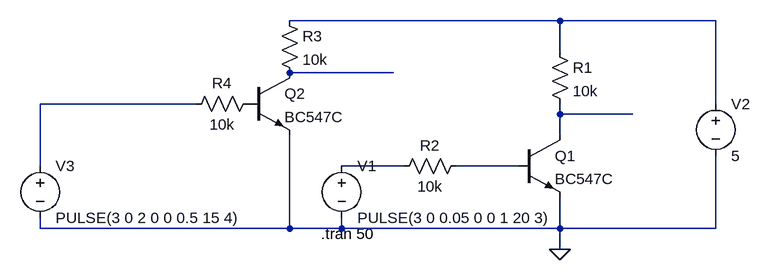
[diagram p0: schematic Agilent-Trigger_Transistor_Simulation.asc]
Agilent-Trigger_Transistor_Simulation.asc, the LTspice schematic file:
Version 4
SHEET 1 880 680
WIRE 240 -64 -176 -64
WIRE 480 -64 240 -64
WIRE 240 -16 240 -64
WIRE -16 16 -176 16
WIRE -320 64 -560 64
WIRE 480 64 480 -64
WIRE 240 80 240 64
WIRE 352 80 240 80
WIRE 240 112 240 80
WIRE -560 160 -560 64
WIRE 0 160 -96 160
WIRE 176 160 80 160
WIRE -560 256 -560 240
WIRE -176 256 -176 112
WIRE -176 256 -560 256
WIRE -96 256 -96 240
WIRE -96 256 -176 256
WIRE 240 256 240 208
WIRE 240 256 -96 256
WIRE 480 256 480 144
WIRE 480 256 240 256
WIRE 240 288 240 256
FLAG 240 288 0
SYMBOL npn 176 112 R0
SYMATTR InstName Q1
SYMATTR Value BC547C
SYMBOL res 224 -32 R0
SYMATTR InstName R1
SYMATTR Value 10k
SYMBOL res 96 144 R90
WINDOW 0 0 56 VBottom 2
WINDOW 3 32 56 VTop 2
SYMATTR InstName R2
SYMATTR Value 10k
SYMBOL voltage -96 144 R0
WINDOW 123 0 0 Left 0
WINDOW 39 0 0 Left 0
SYMATTR InstName V1
SYMATTR Value PULSE(3 0 0.05 0 0 1 20 3)
SYMBOL voltage 480 48 R0
WINDOW 123 0 0 Left 0
WINDOW 39 0 0 Left 0
SYMATTR InstName V2
SYMATTR Value 5
SYMBOL voltage -560 144 R0
WINDOW 123 0 0 Left 0
WINDOW 39 0 0 Left 0
SYMATTR InstName V3
SYMATTR Value PULSE(3 0 2 0 0 0.5 15 4)
SYMBOL npn -240 16 R0
SYMATTR InstName Q2
SYMATTR Value BC547C
SYMBOL res -224 48 R90
WINDOW 0 0 56 VBottom 2
WINDOW 3 32 56 VTop 2
SYMATTR InstName R4
SYMATTR Value 10k
SYMBOL res -192 -80 R0
SYMATTR InstName R3
SYMATTR Value 10k
TEXT -128 264 Left 2 !.tran 50

The netlist it stands for:
* Agilent-Trigger_Transistor_Simulation.asc
Q1 N004 N006 0 0 BC547C
R1 N001 N004 10k
R2 N006 N005 10k
V1 N005 0 PULSE(3 0 0.05 0 0 1 20 3)
V2 N001 0 5
V3 N003 0 PULSE(3 0 2 0 0 0.5 15 4)
Q2 N002 P001 0 0 BC547C
R4 P001 N003 10k
R3 N001 N002 10k
.model NPN NPN
.model PNP PNP
.lib standard.bjt
.tran 50
.backanno
.end